# EAGLE schematic Aux Power Board V2 (EAGLE 9.2.2)

## Sheet 1 of 2
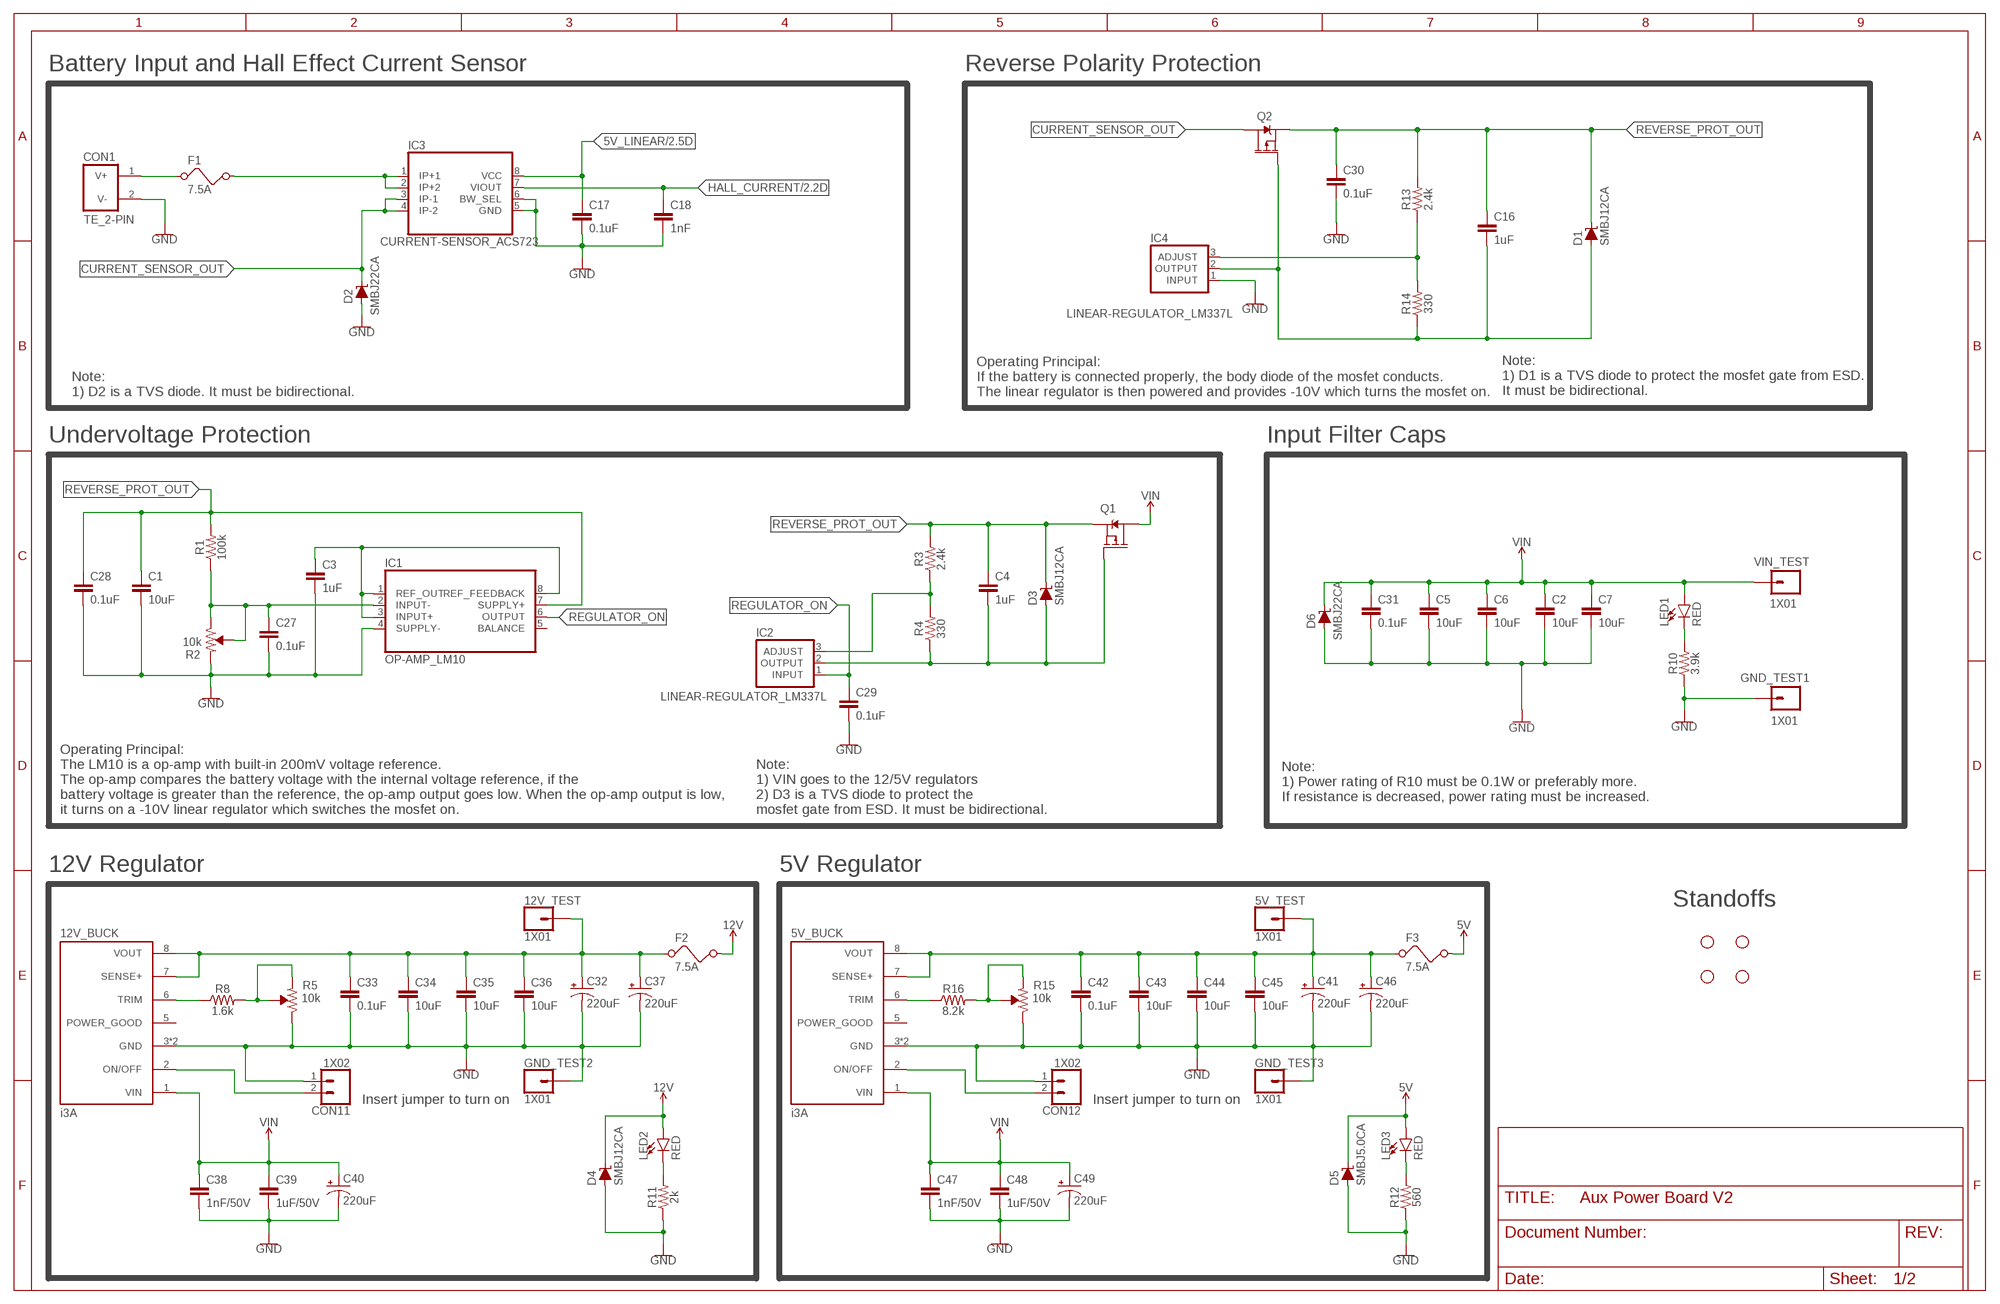
[diagram p0: schematic, sheet 1]

### Parts
5V_BUCK  i3A  CONVERTER_I3A  [CONVERTER_I3A]
5V_TEST  1X01  [1X01]
12V_BUCK  i3A  CONVERTER_I3A  [CONVERTER_I3A]
12V_TEST  1X01  [1X01]
C1  10uF  CAPACITOR_1210  [1210]
C2  10uF  CAPACITOR_1210  [1210]
C3  1uF  CAPACITOR_0805  [0805]
C4  1uF  CAPACITOR_0805  [0805]
C5  10uF  CAPACITOR_1210  [1210]
C6  10uF  CAPACITOR_1210  [1210]
C7  10uF  CAPACITOR_1210  [1210]
C16  1uF  CAPACITOR_0805  [0805]
C17  0.1uF  CAPACITOR_0805  [0805]
C18  1nF  CAPACITOR_0805  [0805]
C27  0.1uF  CAPACITOR_0805  [0805]
C28  0.1uF  CAPACITOR_0805  [0805]
C29  0.1uF  CAPACITOR_0805  [0805]
C30  0.1uF  CAPACITOR_0805  [0805]
C31  0.1uF  CAPACITOR_0805  [0805]
C32  220uF  CAPACITOR_ELECTROLYTIC_220UF  [CAPACITOR_220UF_63V]
C33  0.1uF  CAPACITOR_0805  [0805]
C34  10uF  CAPACITOR_0805  [0805]
C35  10uF  CAPACITOR_0805  [0805]
C36  10uF  CAPACITOR_0805  [0805]
C37  220uF  CAPACITOR_ELECTROLYTIC_220UF  [CAPACITOR_220UF_63V]
C38  1nF/50V  CAPACITOR_0805  [0805]
C39  1uF/50V  CAPACITOR_0805  [0805]
C40  220uF  CAPACITOR_ELECTROLYTIC_220UF  [CAPACITOR_220UF_63V]
C41  220uF  CAPACITOR_ELECTROLYTIC_220UF  [CAPACITOR_220UF_63V]
C42  0.1uF  CAPACITOR_0805  [0805]
C43  10uF  CAPACITOR_0805  [0805]
C44  10uF  CAPACITOR_0805  [0805]
C45  10uF  CAPACITOR_0805  [0805]
C46  220uF  CAPACITOR_ELECTROLYTIC_220UF  [CAPACITOR_220UF_63V]
C47  1nF/50V  CAPACITOR_0805  [0805]
C48  1uF/50V  CAPACITOR_0805  [0805]
C49  220uF  CAPACITOR_ELECTROLYTIC_220UF  [CAPACITOR_220UF_63V]
CON1  TE_2-PIN  [TE_2-PIN]
CON11  1X02  [1X02]
CON12  1X02  [1X02]
D1  SMBJ12CA  DIODE_TVS_DO-214AA  [DO214AA]
D2  SMBJ22CA  DIODE_TVS_DO-214AA  [DO214AA]
D3  SMBJ12CA  DIODE_TVS_DO-214AA  [DO214AA]
D4  SMBJ12CA  DIODE_TVS_DO-214AA  [DO214AA]
D5  SMBJ5.0CA  DIODE_TVS_DO-214AA  [DO214AA]
D6  SMBJ22CA  DIODE_TVS_DO-214AA  [DO214AA]
F1  7.5A  FUSEHOLDER_VERTICAL  [FUSEHOLDER_VERTICAL]
F2  7.5A  FUSEHOLDER_VERTICAL  [FUSEHOLDER_VERTICAL]
F3  7.5A  FUSEHOLDER_VERTICAL  [FUSEHOLDER_VERTICAL]
GND_TEST1  1X01  [1X01]
GND_TEST2  1X01  [1X01]
GND_TEST3  1X01  [1X01]
H1  STAND-OFF  [STAND-OFF]
H2  STAND-OFF  [STAND-OFF]
H3  STAND-OFF  [STAND-OFF]
H4  STAND-OFF  [STAND-OFF]
IC1  OP-AMP_LM10  [DIP08]
IC2  LINEAR-REGULATOR_LM337L  [TO92]
IC3  CURRENT-SENSOR_ACS723  [SOIC8]
IC4  LINEAR-REGULATOR_LM337L  [TO92]
LED1  RED  LED_0805  [0805_LED]
LED2  RED  LED_0805  [0805_LED]
LED3  RED  LED_0805  [0805_LED]
Q1  MOSFET_PMOS_TO-263  [TO-263/D2PAK]
Q2  MOSFET_PMOS_TO-263  [TO-263/D2PAK]
R1  100k  RESISTOR_0805  [0805]
R2  10k  RESISTOR_TRIMPOT  [TRIMPOT]
R3  2.4k  RESISTOR_0805  [0805]
R4  330  RESISTOR_0805  [0805]
R5  10k  RESISTOR_TRIMPOT  [TRIMPOT]
R8  1.6k  RESISTOR_0805  [0805]
R10  3.9k  RESISTOR_0805  [0805]
R11  2k  RESISTOR_0805  [0805]
R12  560  RESISTOR_0805  [0805]
R13  2.4k  RESISTOR_0805  [0805]
R14  330  RESISTOR_0805  [0805]
R15  10k  RESISTOR_TRIMPOT  [TRIMPOT]
R16  8.2k  RESISTOR_0805  [0805]
VIN_TEST  1X01  [1X01]

### Nets
5V: D5.C F3.3 F3.4 LED3.1(A) ; also sheet 2
5V_LINEAR: C17.1 IC3.8(VCC) ; also sheet 2
12V: D4.C F2.3 F2.4 LED2.1(A) ; also sheet 2
BATTERY_IN: CON1.1(V+) F1.1 F1.2
CURRENT_SENSOR_IN: F1.3 F1.4 IC3.1(IP+1) IC3.2(IP+2)
CURRENT_SENSOR_OUT: D2.C IC3.3(IP-1) IC3.4(IP-2) Q2.2(D)
GND: 5V_BUCK.3(GND) 5V_BUCK.4(GND) 12V_BUCK.3(GND) 12V_BUCK.4(GND) C1.2 C2.2 C3.2 C5.2 C6.2 C7.2 C17.2 C18.2 C27.2 C28.2 C29.2 C30.2 C31.2 C32.- C33.2 C34.2 C35.2 C36.2 C37.- C38.2 C39.2 C40.- C41.- C42.2 C43.2 C44.2 C45.2 C46.- C47.2 C48.2 C49.- CON1.2(V-) CON11.1 CON12.1 D2.A D4.A D5.A D6.A GND_TEST1.1 GND_TEST2.1 GND_TEST3.1 IC1.4(SUPPLY-) IC3.5(GND) IC3.6(BW_SEL) IC4.1(INPUT) R2.1(CCW) R5.3(CW) R10.1 R11.1 R12.1 R15.3(CW) ; also sheet 2
HALL_CURRENT: C18.1 IC3.7(VIOUT) ; also sheet 2
N$3: 12V_BUCK.6(TRIM) R8.1
N$4: LED1.2(C) R10.2
N$5: C3.1 IC1.1(REF_OUT) IC1.3(INPUT+) IC1.8(REF_FEEDBACK)
N$6: C27.1 IC1.2(INPUT-) R1.1 R2.2(WIPER) R2.3(CW)
N$7: R5.1(CCW) R5.2(WIPER) R8.2
N$8: C4.2 D3.A IC2.2(OUTPUT) Q1.1(G) R4.1
N$9: IC2.3(ADJUST) R3.1 R4.2
N$11: 5V_BUCK.6(TRIM) R16.1
N$13: LED3.2(C) R12.2
N$17: LED2.2(C) R11.2
N$18: IC4.3(ADJUST) R13.1 R14.2
N$21: C16.2 D1.A IC4.2(OUTPUT) Q2.1(G) R14.1
N$25: 12V_BUCK.7(SENSE+) 12V_BUCK.8(VOUT) 12V_TEST.1 C32.+ C33.1 C34.1 C35.1 C36.1 C37.+ F2.1 F2.2
N$26: R15.1(CCW) R15.2(WIPER) R16.2
N$29: 5V_BUCK.7(SENSE+) 5V_BUCK.8(VOUT) 5V_TEST.1 C41.+ C42.1 C43.1 C44.1 C45.1 C46.+ F3.1 F3.2
N$30: 12V_BUCK.2(ON/OFF) CON11.2
N$33: 5V_BUCK.2(ON/OFF) CON12.2
REGULATOR_ON: C29.1 IC1.6(OUTPUT) IC2.1(INPUT)
REVERSE_PROT_OUT: C1.1 C4.1 C16.1 C28.1 C30.1 D1.C D3.C IC1.7(SUPPLY+) Q1.3(S) Q2.3(S) R1.2 R3.2 R13.2
VIN: 5V_BUCK.1(VIN) 12V_BUCK.1(VIN) C2.1 C5.1 C6.1 C7.1 C31.1 C38.1 C39.1 C40.+ C47.1 C48.1 C49.+ D6.C LED1.1(A) Q1.2(D) VIN_TEST.1 ; also sheet 2
Unconnected: 5V_BUCK.5(POWER_GOOD) 12V_BUCK.5(POWER_GOOD) IC1.5(BALANCE)

### Notes on the sheet
- Battery Input and Hall Effect Current Sensor | Reverse Polarity Protection
- Note: 
  1) D1 is a TVS diode to protect the mosfet gate from ESD. 
  It must be bidirectional.
- Note: 
  1) D2 is a TVS diode. It must be bidirectional.
- Operating Principal: 
  If the battery is connected properly, the body diode of the mosfet conducts.
  The linear regulator is then powered and provides -10V which turns the mosfet on.
- Undervoltage Protection | Input Filter Caps
- Note: 
  1) Power rating of R10 must be 0.1W or preferably more.
  If resistance is decreased, power rating must be increased.
- Operating Principal: 
  The LM10 is a op-amp with built-in 200mV voltage reference.
  The op-amp compares the battery voltage with the internal voltage reference, if the 
  battery voltage is greater than the reference, the op-amp output goes low. When the op-amp output is low, 
  it turns on a -10V linear regulator which switches the mosfet on.
- Note: 
  1) VIN goes to the 12/5V regulators
  2) D3 is a TVS diode to protect the
  mosfet gate from ESD. It must be bidirectional.
- 12V Regulator | 5V Regulator
- Standoffs
- Insert jumper to turn on | Insert jumper to turn on

## Sheet 2 of 2
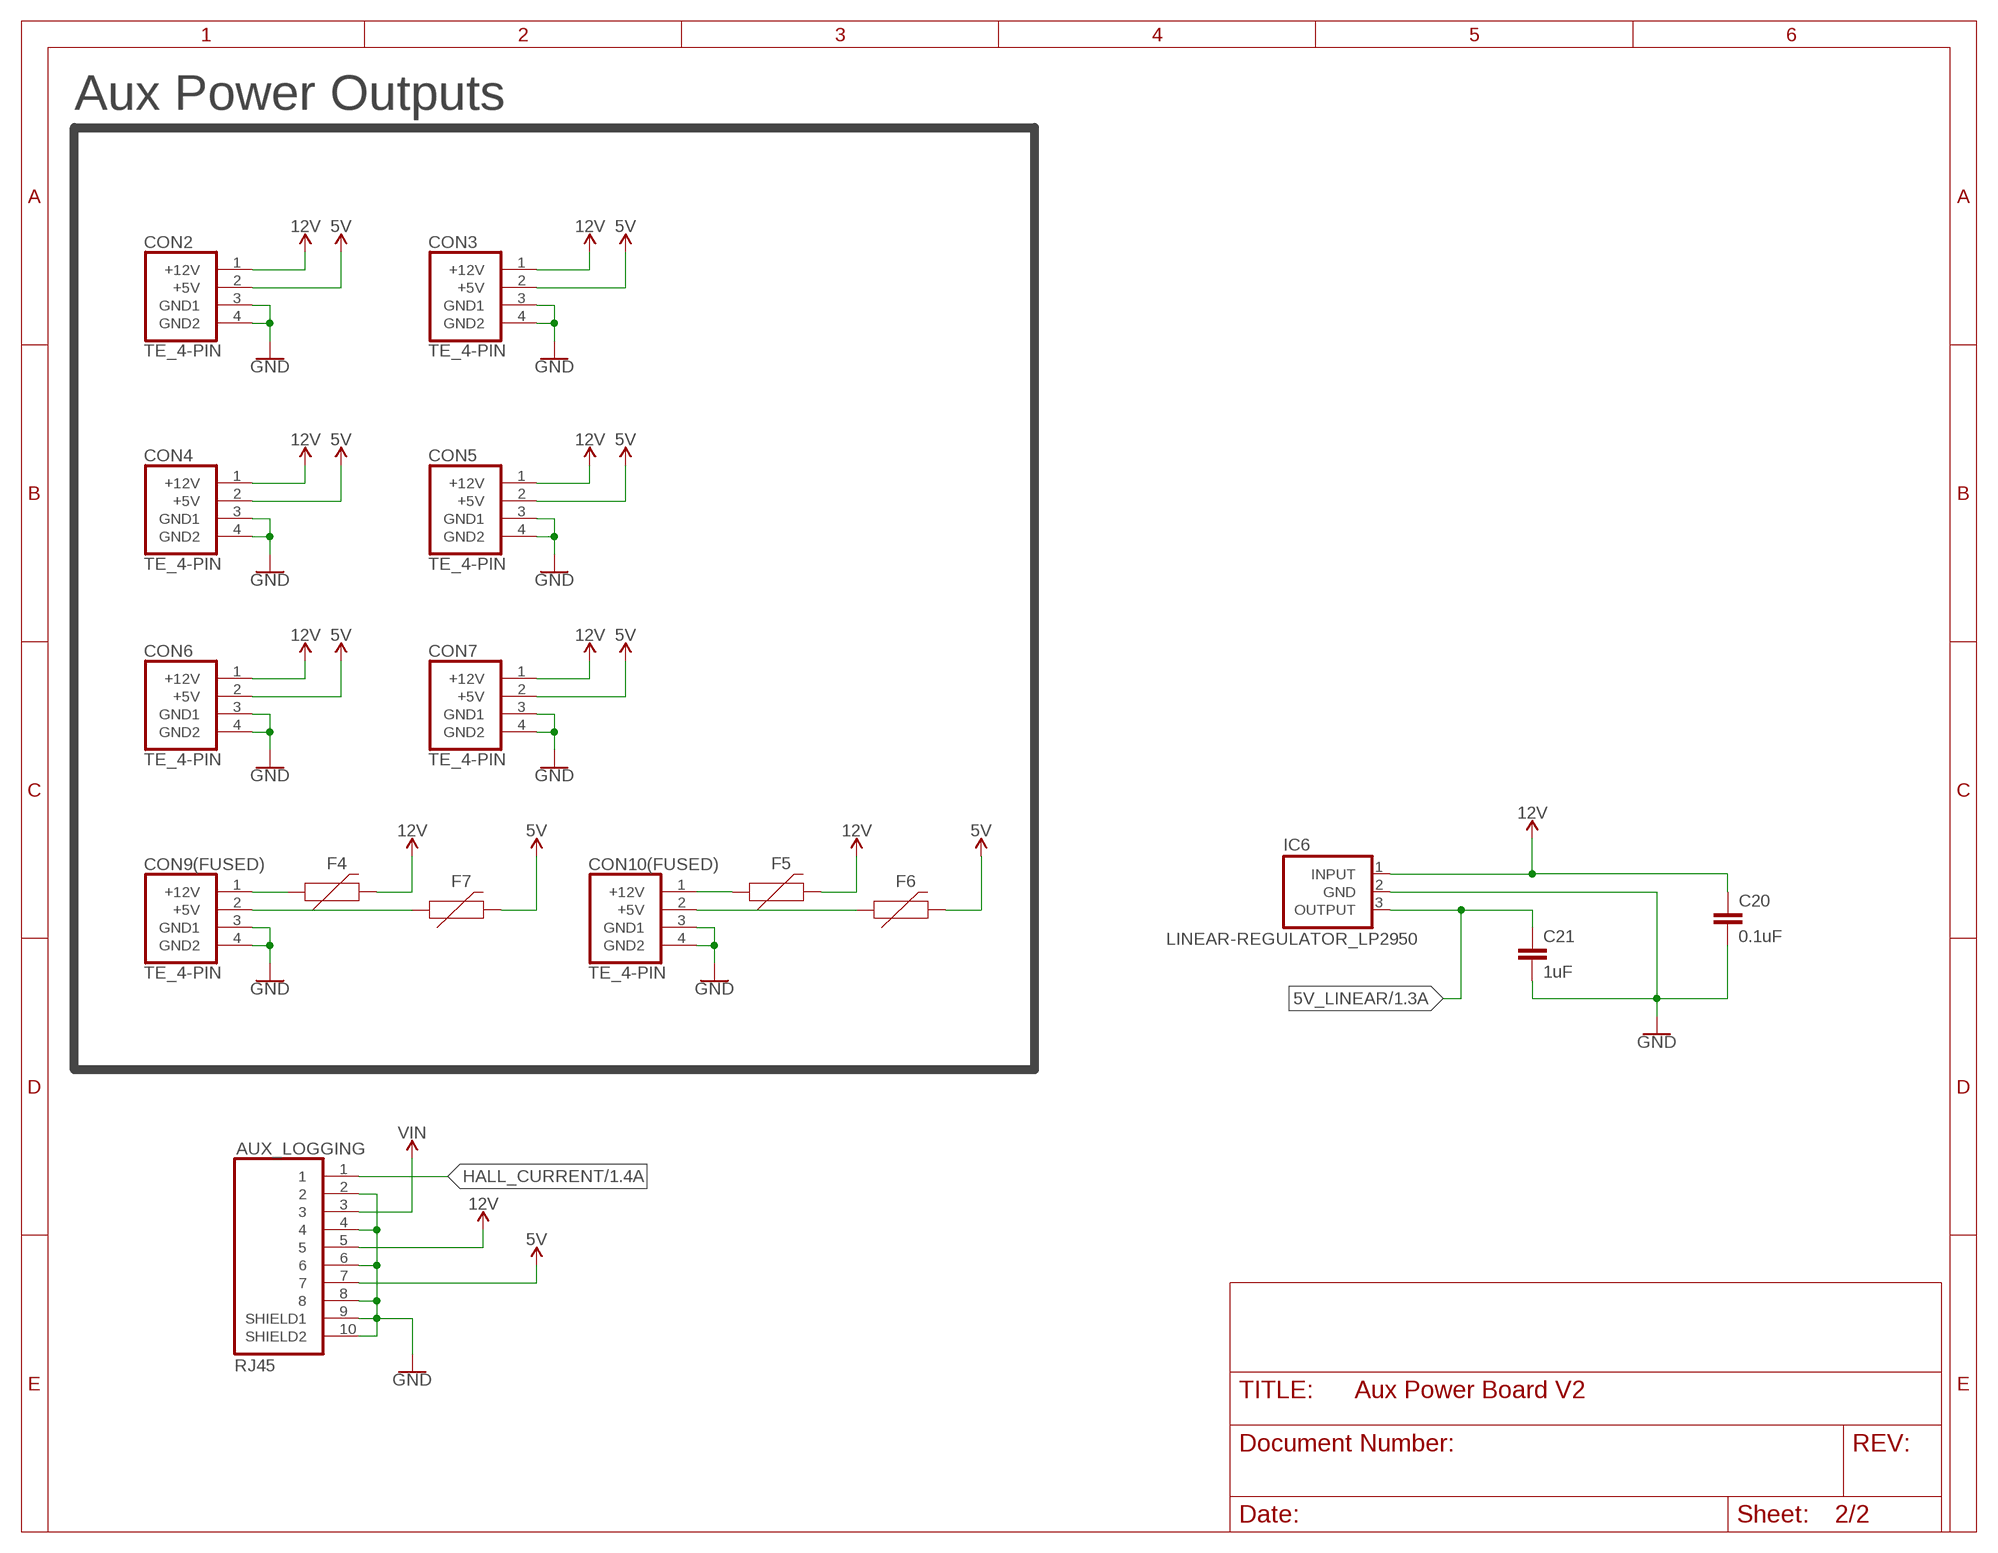
[diagram p1: schematic, sheet 2]

### Parts
AUX_LOGGING  RJ45  [RJ45]
C20  0.1uF  CAPACITOR_0805  [0805]
C21  1uF  CAPACITOR_0805  [0805]
CON2  TE_4-PIN  [TE_4-PIN]
CON3  TE_4-PIN  [TE_4-PIN]
CON4  TE_4-PIN  [TE_4-PIN]
CON5  TE_4-PIN  [TE_4-PIN]
CON6  TE_4-PIN  [TE_4-PIN]
CON7  TE_4-PIN  [TE_4-PIN]
CON9(FUSED)  TE_4-PIN  [TE_4-PIN]
CON10(FUSED)  TE_4-PIN  [TE_4-PIN]
F4  FUSE_1210_RESETTABLE  [1210]
F5  FUSE_1210_RESETTABLE  [1210]
F6  FUSE_1210_RESETTABLE  [1210]
F7  FUSE_1210_RESETTABLE  [1210]
IC6  LINEAR-REGULATOR_LP2950  [TO92]

### Nets
5V: AUX_LOGGING.7 CON2.2(+5V) CON3.2(+5V) CON4.2(+5V) CON5.2(+5V) CON6.2(+5V) CON7.2(+5V) F6.2 F7.2 ; also sheet 1
5V_LINEAR: C21.1 IC6.3(OUTPUT) ; also sheet 1
12V: AUX_LOGGING.5 C20.1 CON2.1(+12V) CON3.1(+12V) CON4.1(+12V) CON5.1(+12V) CON6.1(+12V) CON7.1(+12V) F4.2 F5.2 IC6.1(INPUT) ; also sheet 1
GND: AUX_LOGGING.2 AUX_LOGGING.4 AUX_LOGGING.6 AUX_LOGGING.8 AUX_LOGGING.9(SHIELD1) AUX_LOGGING.10(SHIELD2) C20.2 C21.2 CON2.3(GND1) CON2.4(GND2) CON3.3(GND1) CON3.4(GND2) CON4.3(GND1) CON4.4(GND2) CON5.3(GND1) CON5.4(GND2) CON6.3(GND1) CON6.4(GND2) CON7.3(GND1) CON7.4(GND2) CON9(FUSED).3(GND1) CON9(FUSED).4(GND2) CON10(FUSED).3(GND1) CON10(FUSED).4(GND2) IC6.2(GND) ; also sheet 1
HALL_CURRENT: AUX_LOGGING.1 ; also sheet 1
N$1: CON9(FUSED).2(+5V) F7.1
N$2: CON9(FUSED).1(+12V) F4.1
N$10: CON10(FUSED).1(+12V) F5.1
N$12: CON10(FUSED).2(+5V) F6.1
VIN: AUX_LOGGING.3 ; also sheet 1

### Notes on the sheet
- Aux Power Outputs

## Library data of the parts
5V_BUCK 12V_BUCK = EcoCar-Modules:CONVERTER_I3A: i3A Buck Module (for 12/5V out) Manufacturer: TDK-Lambda Part Number: I3A4W008A033V-001-R Digikey Part Number: 285-2720-ND Note: this version has negative on/off logic and no power good pin
5V_TEST 12V_TEST GND_TEST1-GND_TEST3 VIN_TEST = EcoCar-Connectors-2.54mm:1X01: 2.54mm (0.1") Header
AUX_LOGGING = EcoCar-Connectors:RJ45: RJ45 Connector - Use for signals and low power connections Unshielded Part Number: RJHSE-5080 Unshielded Digikey Part Number: RJHSE-5080-ND Shielded Part Number: RJHSE5E80 Shielded Digikey Part Number: RJHSE5E80-ND
C1 C2 C5-C7 = EcoCar-Passives:CAPACITOR_1210
C3 C4 C16-C18 C20 C21 C27-C31 C33-C36 C38 C39 C42-C45 C47 C48 = EcoCar-Passives:CAPACITOR_0805
C32 C37 C40 C41 C46 C49 = EcoCar-Passives:CAPACITOR_ELECTROLYTIC_220UF: 63V 220uF Low ESR Capacitor Manufacturer: Panasonic Series: FR Part Number: EEU-FR1J221L Digikey Part Number: P15409-ND
CON1 = EcoCar-Connectors:TE_2-PIN: 2 Pin TE Mini-Universal MATE-N-LOK - Use for signals and power connections Part Number: 1-770966-0 Digikey Part Number: A32471-ND Matching Plug: A25587-ND Matching Crimps: A100828CT-ND
CON2-CON7 CON9(FUSED) CON10(FUSED) = EcoCar-Connectors:TE_4-PIN: 4 Pin TE Mini-Universal MATE-N-LOK - Use for 12V and 5V connections Part Number: 1-770968-0 Digikey Part Number: A32474-ND Matching Plug: A25571-ND Matching Crimps: A100828CT-ND
CON11 CON12 = EcoCar-Connectors-2.54mm:1X02: 2.54mm (0.1") Header
D1-D6 = EcoCar-Fuses-Protection:DIODE_TVS_DO-214AA
F1-F3 = EcoCar-Fuses-Protection:FUSEHOLDER_VERTICAL: Vertical Fuse Holder for Mini Blade Fuses Manufacturer: Keystone Part Number: 3568 Digikey Part Number: 36-3568-ND
F4-F7 = EcoCar-Fuses-Protection:FUSE_1210_RESETTABLE: 1210 Resettable PTC Fuse
H1-H4 = EcoCar-Miscellaneous:STAND-OFF: Stand Off Drill holes for mechanically mounting via screws, standoffs, etc. Note: Use the keepout ring to avoid running the screw head into surrounding components. Variant Overviews STAND-OFF - Mechanical footprint for a #4 phillips button head screw. STAND-OFF-TIGHT - Mechanical footprint for a #4 phillips button head screw, Example SparkFun Products Screw - Phillips Head (1/4", 4-40, 10 pack) <https://www.sparkfun.com/products/10453> (PRT-10453) Screw - Phillips Head (1/2", 4-40, 10 pack) <https://www.sparkfun.com/products/10452> (PRT-10452) Screw - Phillips Head (3/4", 4-40, 10 pack) <https://www.sparkfun.com/products/10451> (PRT-10451) Screw - Phillips Head (1", 4-40, 10 pack) <https://www.sparkfun.com/products/10450> (PRT-10450)
IC1 = EcoCar-Integrated-Circuits:OP-AMP_LM10: Op-Amp with Internal Voltage Reference Manufacturer: Texas Instruments Part Number: LM10CN/NOPB Digikey Part Number: LM10CN/NOPB-ND
IC2 IC4 = EcoCar-Integrated-Circuits:LINEAR-REGULATOR_LM337L: Adjustable Negative Linear Voltage Regulator Manufacturer: Texas Instruments Part Number: LM337LZ/NOPB Digikey Part Number: LM337LZ/NOPB-ND
IC3 = EcoCar-Integrated-Circuits:CURRENT-SENSOR_ACS723: 10A Hall Effect Current Sensor Manufacturer: Allegro MicroSystems Part Number: ACS723LLCTR-10AU-T Digikey Part Number: 620-1643-1-ND Note: pinout fixed Nov 28, 2019
IC6 = EcoCar-Integrated-Circuits:LINEAR-REGULATOR_LP2950: 5V Linear Regulator Manufacturer: Texas Instruments Part Number: LP2950-50LPRE3 Digikey Part Number: 296-20933-1-ND
LED1-LED3 = EcoCar-Discrete-Semiconductors:LED_0805
Q1 Q2 = EcoCar-Discrete-Semiconductors:MOSFET_PMOS_TO-263
R1 R3 R4 R8 R10-R14 R16 = EcoCar-Passives:RESISTOR_0805
R2 R5 R15 = EcoCar-Passives:RESISTOR_TRIMPOT: Bourns Trimpot Example Part: 10k trimpot Manufacturer: Bourns Part Number: PV36W103C01B00 Digikey Part Number: 490-2875-ND